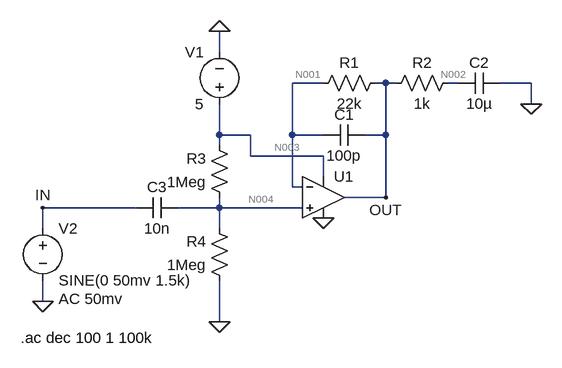
[diagram p0: schematic Draft3.asc]
Draft3.asc, the LTspice schematic file:
Version 4
SHEET 1 880 680
WIRE 112 -96 112 -128
WIRE 272 -48 224 -48
WIRE 368 -48 352 -48
WIRE 384 -48 368 -48
WIRE 480 -48 464 -48
WIRE 592 -48 544 -48
WIRE 592 -16 592 -48
WIRE 112 32 112 -16
WIRE 160 32 112 32
WIRE 224 32 224 -48
WIRE 272 32 224 32
WIRE 368 32 368 -48
WIRE 368 32 336 32
WIRE 112 48 112 32
WIRE 160 64 160 32
WIRE 272 64 160 64
WIRE 272 96 272 64
WIRE 224 112 224 32
WIRE 240 112 224 112
WIRE 368 128 368 32
WIRE 368 128 304 128
WIRE -16 144 -160 144
WIRE 112 144 112 128
WIRE 112 144 48 144
WIRE 240 144 112 144
WIRE -160 176 -160 144
WIRE 112 176 112 144
WIRE -160 288 -160 256
WIRE 112 320 112 256
FLAG 272 160 0
FLAG 112 -128 0
FLAG 592 -16 0
FLAG 112 320 0
FLAG -160 288 0
FLAG 368 128 OUT
FLAG -160 144 IN
SYMBOL OpAmps\\UniversalOpAmp2 272 128 R0
SYMATTR InstName U1
SYMBOL voltage 112 0 R180
WINDOW 0 24 96 Left 2
WINDOW 3 24 16 Left 2
SYMATTR InstName V1
SYMATTR Value 5
SYMBOL cap 336 16 R90
WINDOW 0 0 32 VBottom 2
WINDOW 3 32 32 VTop 2
SYMATTR InstName C1
SYMATTR Value 100p
SYMBOL res 368 -64 R90
WINDOW 0 0 56 VBottom 2
WINDOW 3 32 56 VTop 2
SYMATTR InstName R1
SYMATTR Value 22k
SYMBOL res 480 -64 R90
WINDOW 0 0 56 VBottom 2
WINDOW 3 32 56 VTop 2
SYMATTR InstName R2
SYMATTR Value 1k
SYMBOL cap 544 -64 R90
WINDOW 0 0 32 VBottom 2
WINDOW 3 32 32 VTop 2
SYMATTR InstName C2
SYMATTR Value 10µ
SYMBOL res 128 144 R180
WINDOW 0 36 76 Left 2
WINDOW 3 36 40 Left 2
SYMATTR InstName R3
SYMATTR Value 1Meg
SYMBOL res 128 272 R180
WINDOW 0 36 76 Left 2
WINDOW 3 36 40 Left 2
SYMATTR InstName R4
SYMATTR Value 1Meg
SYMBOL cap 48 128 R90
WINDOW 0 0 32 VBottom 2
WINDOW 3 32 32 VTop 2
SYMATTR InstName C3
SYMATTR Value 10n
SYMBOL voltage -160 160 R0
WINDOW 123 24 124 Left 2
WINDOW 39 0 0 Left 0
SYMATTR InstName V2
SYMATTR Value SINE(0 50mv 1.5k)
SYMATTR Value2 AC 50mv
TEXT -194 344 Left 2 !.ac dec 100 1 100k

The netlist it stands for:
* Draft3.asc
XU1 N004 N001 N003 0 OUT level2 Avol=1Meg GBW=10Meg Slew=10Meg Ilimit=25m Rail=0 Vos=0 En=0 Enk=0 In=0 Ink=0 Rin=500Meg  ; pins In+ In- V+ V- OUT
V1 N003 0 5
C1 OUT N001 100p
R1 OUT N001 22k
R2 N002 OUT 1k
C2 0 N002 10µ
R3 N004 N003 1Meg
R4 0 N004 1Meg
C3 N004 IN 10n
V2 IN 0 SINE(0 50mv 1.5k) AC 50mv
.ac dec 100 1 100k
.lib UniversalOpAmp2.lib
.backanno
.end

* Results of the author's LTspice run, read from the files saved beside the schematic
* Operating Point, zero values left out:
*   V(out) = 2.5 V
*   V(n003) = 5 V
*   V(n001) = 2.5 V
*   V(n004) = 2.5 V
*   V(n002) = 2.5 V
*   I(R3) = -2.5 µA
*   I(R4) = -2.5 µA
*   I(V1) = -252.5 µA
*   Ix(u1:3) = 250 µA
*   Ix(u1:4) = -250 µA
*   Ix(u1:5) = 198 pA
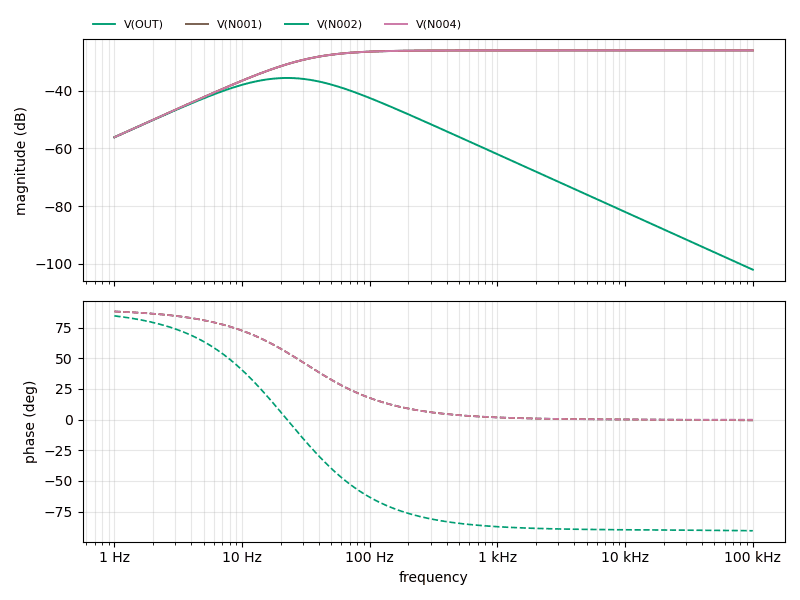
[diagram p1: AC Analysis of Draft3.asc, plotted from the saved traces]
* AC Analysis, 1 run:
*   V(OUT): -56.09 dB at 1 Hz, -26.02 dB at 100 kHz, peak -26.02 dB at 13.8 kHz, 3 dB below the peak at 31.86 Hz
*   V(N001): -56.09 dB at 1 Hz, -26.02 dB at 100 kHz, peak -26.02 dB at 17.38 kHz, 3 dB below the peak at 31.86 Hz
*   V(N002): -56.11 dB at 1 Hz, -101.98 dB at 100 kHz, peak -35.57 dB at 22.39 Hz, 3 dB below the peak at 8.941 Hz and 56.72 Hz
*   V(N004): -56.09 dB at 1 Hz, -26.02 dB at 100 kHz, peak -26.02 dB at 100 kHz, 3 dB below the peak at 31.86 Hz